# EAGLE design sensor_board_v0.3 (EAGLE 7.6.0)
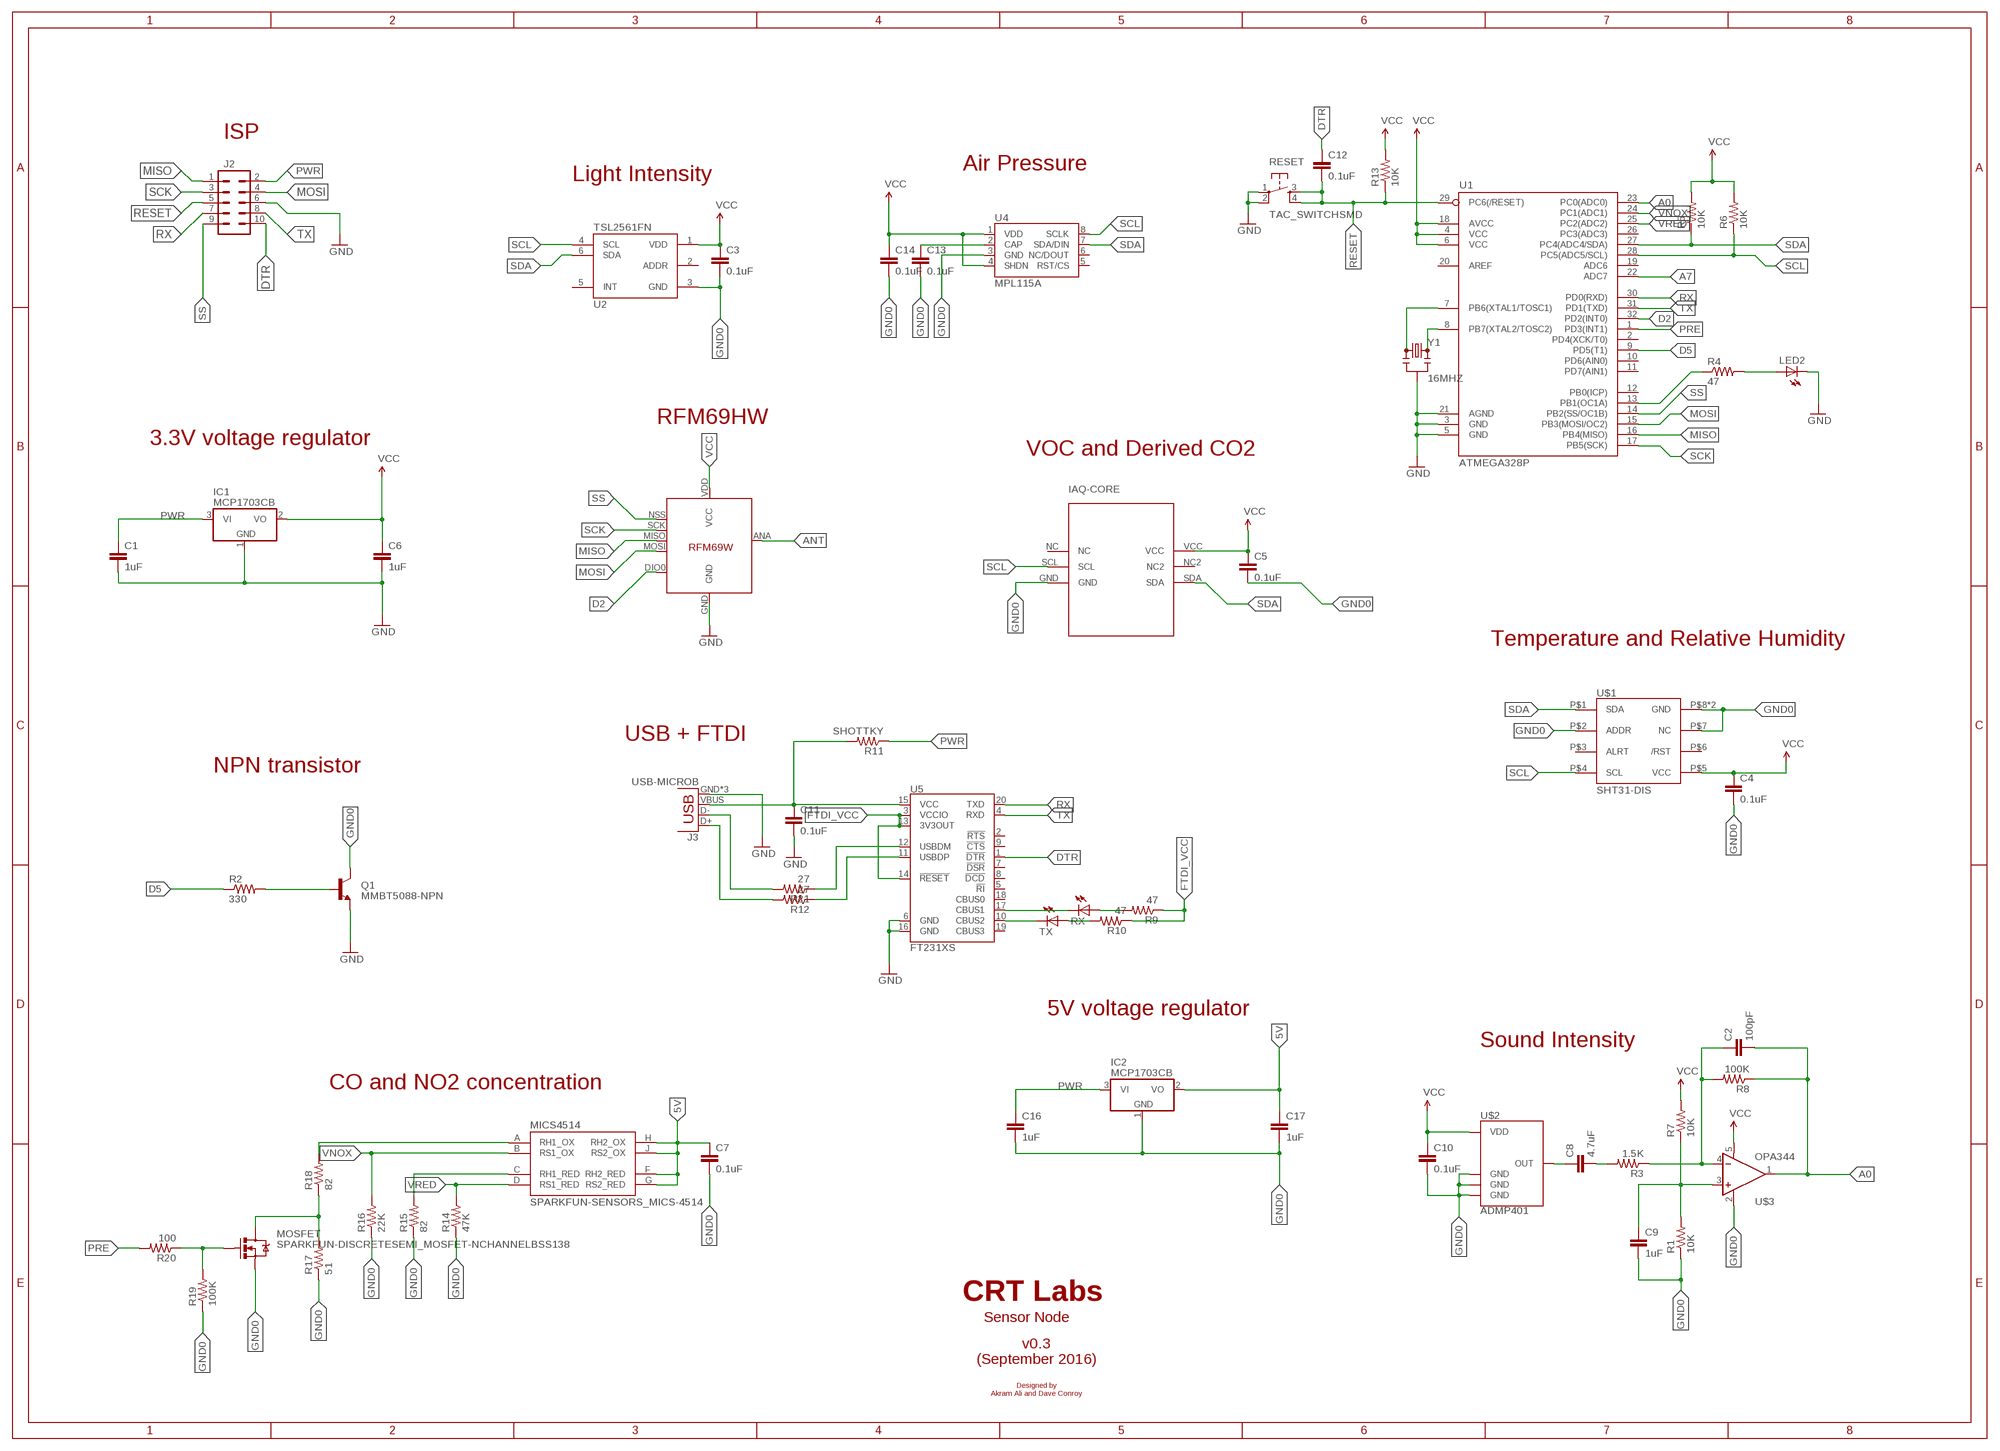
[diagram p0: schematic, sheet 1]

## Parts
C1  1uF  CAP0805  [0805]
C2  100pF  CAP0805  [0805]
C3  0.1uF  CAP0805  [0805]
C4  0.1uF  CAP0805  [0805]
C5  0.1uF  CAP0805  [0805]
C6  1uF  CAP0805  [0805]
C7  0.1uF  CAP0805  [0805]
C8  4.7uF  CAP0805  [0805]
C9  1uF  CAP0805  [0805]
C10  0.1uF  CAP0805  [0805]
C11  0.1uF  CAP0805  [0805]
C12  0.1uF  CAP0805  [0805]
C13  0.1uF  CAP0805  [0805]
C14  0.1uF  CAP0805  [0805]
C16  1uF  CAP0805  [0805]
C17  1uF  CAP0805  [0805]
IAQ-CORE  IAQ-CORE  [IAQ-CORE]
IC1  MCP1703CB  [SOT23]
IC2  MCP1703CB  [SOT23]
J2  M05X2PTH  [AVR_ICSP]
J3  USB-MICROB  [USB-MICROB]
LED2  LEDCHIPLED_0805  [CHIPLED_0805]
MICS4514  SPARKFUN-SENSORS_MICS-4514  [SPARKFUN-SENSORS_MICS_10-SMD]
MOSFET  SPARKFUN-DISCRETESEMI_MOSFET-NCHANNELBSS138  [SPARKFUN-DISCRETESEMI_SOT23-3]
Q1  MMBT5088-NPN  TRANSISTOR_NPNMMBT5088  [SOT23-3]
R1  10K  RESISTOR0805-RES  [0805]
R2  330  RESISTOR0805-RES  [0805]
R3  1.5K  RESISTOR0805-RES  [0805]
R4  47  RESISTOR0805-RES  [0805]
R5  10K  RESISTOR0805-RES  [0805]
R6  10K  RESISTOR0805-RES  [0805]
R7  10K  RESISTOR0805-RES  [0805]
R8  100K  RESISTOR0805-RES  [0805]
R9  47  RESISTOR0805-RES  [0805]
R10  47  RESISTOR0805-RES  [0805]
R11  SHOTTKY  RESISTOR0805-RES  [0805]
R12  27  RESISTOR0805-RES  [0805]
R13  10K  RESISTOR0805-RES  [0805]
R14  47K  RESISTOR0805-RES  [0805]
R15  82  RESISTOR0805-RES  [0805]
R16  22K  RESISTOR0805-RES  [0805]
R17  51  RESISTOR0805-RES  [0805]
R18  82  RESISTOR0805-RES  [0805]
R19  100K  RESISTOR0805-RES  [0805]
R20  100  RESISTOR0805-RES  [0805]
R21  27  RESISTOR0805-RES  [0805]
RESET  TAC_SWITCHSMD  [TACTILE-SWITCH-SMD]
RX  LEDCHIPLED_0805  [CHIPLED_0805]
TX  LEDCHIPLED_0805  [CHIPLED_0805]
U1  ATMEGA328P  ATMEGA328P_TQFP  [TQFP32-08]
U2  TSL2561FN  [FN-6]
U4  MPL115A  [LGA8]
U5  FT231XS  [SSOP20_L]
U$1  SHT31-DIS  [SHT3X]
U$2  ADMP401  [ADMP401]
U$3  OPA344  [SOT23-5]
U$4  RFM69HW  LOWPOWERLAB_RFM69  [LOWPOWERLAB_RFM69W-MINPADS]
Y1  16MHZ  RESONATOR16MHZ  [RESONATOR-SMD]

## Nets
5V: C7.1 C17.1 IC2.2(VO) MICS4514.F(RH2_RED) MICS4514.G(RS2_RED) MICS4514.H(RH2_OX) MICS4514.J(RS2_OX)
A0: C2.2 R8.1 U1.23(PC0(ADC0)) U$3.1(OUT)
A7: U1.22(ADC7)
ANT: U$4.ANA(ANT)
D2: U1.32(PD2(INT0)) U$4.DIO0
D5: R2.1 U1.9(PD5(T1))
DTR: C12.1 J2.10 U5.1(!DTR)
FTDI_VCC: R9.1 R10.1 U5.3(VCCIO) U5.13(3V3OUT) U5.14(!RESET)
GND: C1.2 C6.2 C11.2 IC1.1(GND) J2.6 J3.GND J3.MT1(GND) J3.MT2(GND) LED2.C Q1.2(E) RESET.1 RESET.2 U1.3(GND) U1.5(GND) U1.21(AGND) U5.6(GND) U5.16(GND) U$4.GND Y1.2
GND0: C3.2 C4.2 C5.2 C7.2 C9.2 C10.2 C13.2 C14.2 C16.2 C17.2 IAQ-CORE.GND IC2.1(GND) MOSFET.2(S) Q1.3(C) R1.1 R14.1 R15.1 R16.1 R17.1 R19.1 U2.3(GND) U4.3(GND) U$1.P$2(ADDR) U$1.P$7(NC) U$1.P$8(GND) U$1.PAD(GND) U$2.2(GND) U$2.4(GND) U$2.6(GND) U$3.2(V-)
MISO: J2.1 U1.16(PB4(MISO)) U$4.MISO
MOSI: J2.4 U1.15(PB3(MOSI/OC2)) U$4.MOSI
N$1: Q1.1(B) R2.2
N$2: R4.1 U1.13(PB1(OC1A))
N$3: LED2.A R4.2
N$4: U1.8(PB7(XTAL2/TOSC2)) Y1.3
N$5: U1.7(PB6(XTAL1/TOSC1)) Y1.1
N$7: C8.1 U$2.1(OUT)
N$8: MICS4514.A(RH1_OX) R18.2
N$9: C8.2 R3.2
N$10: C2.1 R3.1 R8.2 U$3.4(-IN)
N$11: C9.1 R1.2 R7.1 U$3.3(+IN)
N$12: C13.1 U4.2(CAP)
N$13: MICS4514.C(RH1_RED) R15.2
N$17: RX.C U5.17(CBUS1)
N$18: TX.C U5.10(CBUS2)
N$20: MOSFET.3(D) R17.2 R18.1
N$23: MOSFET.1(G) R19.2 R20.1
N$24: C11.1 J3.VBUS R11.2 U5.15(VCC)
N$25: R21.1 U5.12(USBDM)
N$26: R12.1 U5.11(USBDP)
N$27: R9.2 RX.A
N$29: R10.2 TX.A
N$32: J3.D- R21.2
N$33: J3.D+ R12.2
PRE: R20.2 U1.1(PD3(INT1))
PWR: C1.1 C16.1 IC1.3(VI) IC2.3(VI) J2.2 R11.1
RESET: C12.2 J2.5 R13.1 RESET.3 RESET.4 U1.29(PC6(/RESET))
RX: J2.7 U1.30(PD0(RXD)) U5.20(TXD)
SCK: J2.3 U1.17(PB5(SCK)) U$4.SCK
SCL: IAQ-CORE.SCL R6.1 U1.28(PC5(ADC5/SCL)) U2.4(SCL) U4.8(SCLK) U$1.P$4(SCL)
SDA: IAQ-CORE.SDA R5.1 U1.27(PC4(ADC4/SDA)) U2.6(SDA) U4.7(SDA/DIN) U$1.P$1(SDA)
SS: J2.9 U1.14(PB2(SS/OC1B)) U$4.NSS(SEL)
TX: J2.8 U1.31(PD1(TXD)) U5.4(RXD)
VCC: C3.1 C4.1 C5.1 C6.1 C10.1 C14.1 IAQ-CORE.VCC IC1.2(VO) R5.2 R6.2 R7.2 R13.2 U1.4(VCC) U1.6(VCC) U1.18(AVCC) U2.1(VDD) U4.1(VDD) U4.4(SHDN) U$1.P$5(VCC) U$2.5(VDD) U$3.5(V+) U$4.VDD(VCC)
VNOX: MICS4514.B(RS1_OX) R16.2 U1.24(PC1(ADC1))
VRED: MICS4514.D(RS1_RED) R14.2 U1.25(PC2(ADC2))
Unconnected: IAQ-CORE.NC IAQ-CORE.NC2 U1.2(PD4(XCK/T0)) U1.10(PD6(AIN0)) U1.11(PD7(AIN1)) U1.12(PB0(ICP)) U1.19(ADC6) U1.20(AREF) U1.26(PC3(ADC3)) U2.2(ADDR) U2.5(INT) U4.5(RST/CS) U4.6(NC/DOUT) U5.2(!RTS) U5.5(!RI) U5.7(!DSR) U5.8(!DCD) U5.9(!CTS) U5.18(CBUS0) U5.19(CBUS3) U$1.P$3(ALRT) U$1.P$6(/RST)

## Notes on the sheet
- ISP
- Air Pressure
- Light Intensity
- RFM69HW
- 3.3V voltage regulator
- VOC and Derived CO2
- Temperature and Relative Humidity
- USB + FTDI
- NPN transistor
- 5V voltage regulator
- Sound Intensity
- CO and NO2 concentration
- CRT Labs
- Sensor Node
- v0.3
  (September 2016)
- Designed by
  Akram Ali and Dave Conroy

## Library data of the parts
C1 C2 C6 C8-C11 C16 C17 = SparkFun-Capacitors:CAP: Capacitor Standard 0603 ceramic capacitor, and 0.1" leaded capacitor.; OC_NEWARK: unknown
C3-C5 C7 = SparkFun-Passives:CAP: Capacitor Standard 0603 ceramic capacitor, and 0.1" leaded capacitor.; OC_NEWARK: unknown
C12-C14 = SparkFun-Passives:CAP: Capacitor Standard 0603 ceramic capacitor, and 0.1" leaded capacitor.
IAQ-CORE = IAQ-CORE:IAQ-CORE; MPN: IAQ CORE; OC_NEWARK: 82Y5455
IC1 IC2 = linear:MCP1703: 250 mA, 16V, Low Quiescent Current LDO Regulator Source: http://ww1.microchip.com/downloads/en/DeviceDoc/22049b.pdf; MPN: MCP1703T-2502E/CB; OC_NEWARK: 18T9177
J2 = SparkFun-Connectors:M05X2: Header 5x2 Standard 10-pin dual row 0.1" header. Commonly used with AVR-ISP. Use with Spark Fun Electronics SKU: PRT-00778
J3 = SparkFun-Connectors:USB: USB Connectors USB-B-PTH is fully proven SKU : PRT-00139/CONN-08278 USB-miniB is fully proven SKU : PRT-00587 USB-A-PCB is untested. USB-A-H is throughly reviewed, but untested. Spark Fun Electronics SKU : PRT-00437 USB-B-SMT is throughly reviewed, but untested. Needs silkscreen touching up. USB-A-S has not been used/tested USB-MB-H has not been used/tested USB-MICROB has been used. CONN-09505; PROD_ID: CONN-09505
LED2 RX TX = adafruit:LED: LED OSRAM: - CHIPLED LG R971, LG N971, LY N971, LG Q971, LY Q971, LO R971, LY R971 LH N974, LH R974 LS Q976, LO Q976, LY Q976 LO Q996 - Hyper CHIPLED LW Q18S LB Q993, LB Q99A, LB R99A - SideLED LS A670, LO A670, LY A670, LG A670, LP A670 LB A673, LV A673, LT A673, LW A673 LH A674 LY A675 LS A676, LA A676, LO A676, LY A676, LW A676 LS A679, LY A679, LG A679 - Hyper Micro SIDELED® LS Y876, LA Y876, LO Y876, LY Y876 LT Y87S - SmartLED LW L88C, LW L88S LB L89C, LB L89S, LG L890 LS L89K, LO L89K, LY L89K LS L896, LA L896, LO L896, LY L896 - TOPLED LS T670, LO T670, LY T670, LG T670, LP T670 LSG T670, LSP T670, LSY T670, LOP T670, LYG T670 LG T671, LOG T671, LSG T671 LB T673, LV T673, LT T673, LW T673 LH T674 LS T676, LA T676, LO T676, LY T676, LB T676, LH T676, LSB T676, LW T676 LB T67C, LV T67C, LT T67C, LS T67K, LO T67K, LY T67K, LW E67C LS E67B, LA E67B, LO E67B, LY E67B, LB E67C, LV E67C, LT E67C LW T67C LS T679, LY T679, LG T679 LS T770, LO T770, LY T770, LG T770, LP T770 LB T773, LV T773, LT T773, LW T773 LH T774 LS E675, LA E675, LY E675, LS T675 LS T776, LA T776, LO T776, LY T776, LB T776 LHGB T686 LT T68C, LB T68C - Hyper Mini TOPLED® LB M676 - Mini TOPLED Santana® LG M470 LS M47K, LO M47K, LY M47K Source: http://www.osram.convergy.de/; OC_NEWARK: unknown
MICS4514 = MICS-4514_CO_and_NOx_Sensor_Breakout:SPARKFUN-SENSORS_MICS-4514: Metal oxide MEMS carbon monoxide (CO) and NOx sensor in an SMD package.; PROD_ID: COMP-12310
MOSFET = MICS-4514_CO_and_NOx_Sensor_Breakout:SPARKFUN-DISCRETESEMI_MOSFET-NCHANNEL: Common NMOSFET Parts MFG P/N Store ID Prod ID FDD8780 TRANS-09984 SI7820DN TRANS-11055 FDS6630A IC-08089 2N7002PW TRANS-11151 FQP30N06L COM-10213 TRANS-10060 BSS123LT1G TRANS-08345 BSS138 TRANS-00830 BS170 2N7000; PROD_ID: TRANS-00830
Q1 = SparkFun-DiscreteSemi:TRANSISTOR_NPN: Generic NPN BJT MMBT2222A - TRANS-08049 (SOT-23, 1A 40V) MPSA42 - TRANS-09116 (SOT-23, 500mA 300V) MMBT5088LT1G - TRANS-11160 (SOT-23, 50 mA 30V) BC547 - COM-08928 <http://www.sparkfun.com/products/8928> (TO-92 45V 100mA) (1.Collector 2.Base 3.Emitter) 2N3904 - COM-00521 <http://www.sparkfun.com/products/521> (TO-92 40V 200mA) (1.Emitter 2.Base 3.Collector) P2N2222A - COM-12852 <http://www.sparkfun.com/products/12852> (TO-92 40V 600mA) (1.Collector 2.Base 3.Emitter); OC_NEWARK: unknown; PROD_ID: TRANS-11160; VALUE: MMBT5088
R1-R3 R7-R12 R14-R21 = SparkFun-Passives:RESISTOR: Resistor Basic schematic elements and footprints for 0603, 1206, and PTH resistors.; OC_NEWARK: unknown
R4-R6 = SparkFun-Resistors:RESISTOR: Resistor Basic schematic elements and footprints for 0603, 1206, and PTH resistors.; OC_NEWARK: unknown
R13 = SparkFun-Passives:RESISTOR: Resistor Basic schematic elements and footprints for 0603, 1206, and PTH resistors.
RESET = SparkFun-Retired:TAC_SWITCH: Momentary Switch Button commonly used for reset or general input. Spark Fun Electronics SKU : COM-00097 SMT- SWCH-08247; PROD_ID: SWCH-08247
U1 = SparkFun-DigitalIC:ATMEGA328P_TQFP; MPN: ATMEGA328PB-AU; OC_NEWARK: 58Y6083; PROD_ID: IC-09069; VALUE: ATMEGA328P_TQFP
U2 = SparkFun-DigitalIC:TSL2561: TSL2561 illumination sensor Approximates Human Eye Response Precisely Measures Illuminance Programmable Interrupt Function with User-Defined Upper and Lower Threshold 400 KHz I2C interface Programmable Analog Gain and Integration Time Supporting 1,000,000-to-1 Dynamic Range Automatically Rejects 50/60-Hz Lighting Ripple Low Active Power (0.75 mW Typical) with Power Down Mode RoHS Compliant The TSL2561 is a light-to-digital converter that transform light intensity to a digital signal output via I2C interface. The device combines one broadband photodiode (visible plus infrared) and one infrared-responding photodiode on a single CMOS integrated circuit capable of providing a near-photopic response over an effective 20-bit dynamic range (16-bit resolution). Two integrating ADCs convert the photodiode currents to a digital output that represents the irradiance measured on each channel. This digital output can be input to a microprocessor where illuminance (ambient light level) in lux is derived using an empirical formula to approximate the human eye response. The TSL2561 device supports a traditional level style interrupt that remains asserted until the firmware clears it.; DIGIKEY#: TSL2561-FNCT-ND; MANF: AMS-TAOS-USA-Inc.; MANF#: TSL2561FN; MOUSER#: 856-TSL2561T; MPN: TSL2561FN; OC_NEWARK: 82Y5564; PROD_ID: IC-11791
U4 = SparkFun-Sensors:MPL115A: MPL115A1 (SPI) and MPL115A2 (I2C) Miniature Digital Barometer 5.0x3.0x1.2mm LGA Package
U5 = SparkFun-DigitalIC:FT231X: FTDI FT231X Full Speed USB to Full-handshake UART This USB2.0 Full Speed IC offers a compact bridge to full handshake UART interfaces. The device is a UART, capable of operating up to 3MBaud, with low power consumption (8mA). The FT231X includes the complete FT-X series feature set and enables USB to be added into a system design quickly and easily over a UART interface.; PROD_ID: IC-11524
U$1 = thomasb9511:SHT31-DIS; MPN: SHT31-DIS-B; OC_NEWARK: 47Y1304
U$2 = SparkFun-Sensors:ADMP401: Omnidirection bottom-port MEMS microphone
U$3 = SparkFun-AnalogIC:OPA344: Single gate rail-to-rail output op-amp. Inputs extend 300mV past rails.; PROD_ID: IC-08251
U$4 = RFM69 USB Gateway:LOWPOWERLAB_RFM69
Y1 = SparkFun-FreqCtrl:RESONATOR: Resonator Small SMD resonator. Used, eg, on the Arduino Pro/ Pro Mini boards. 8MHz- XTAL-08895 16MHz- XTAL-08900; OC_NEWARK: unknown; PROD_ID: XTAL-08900

## Board
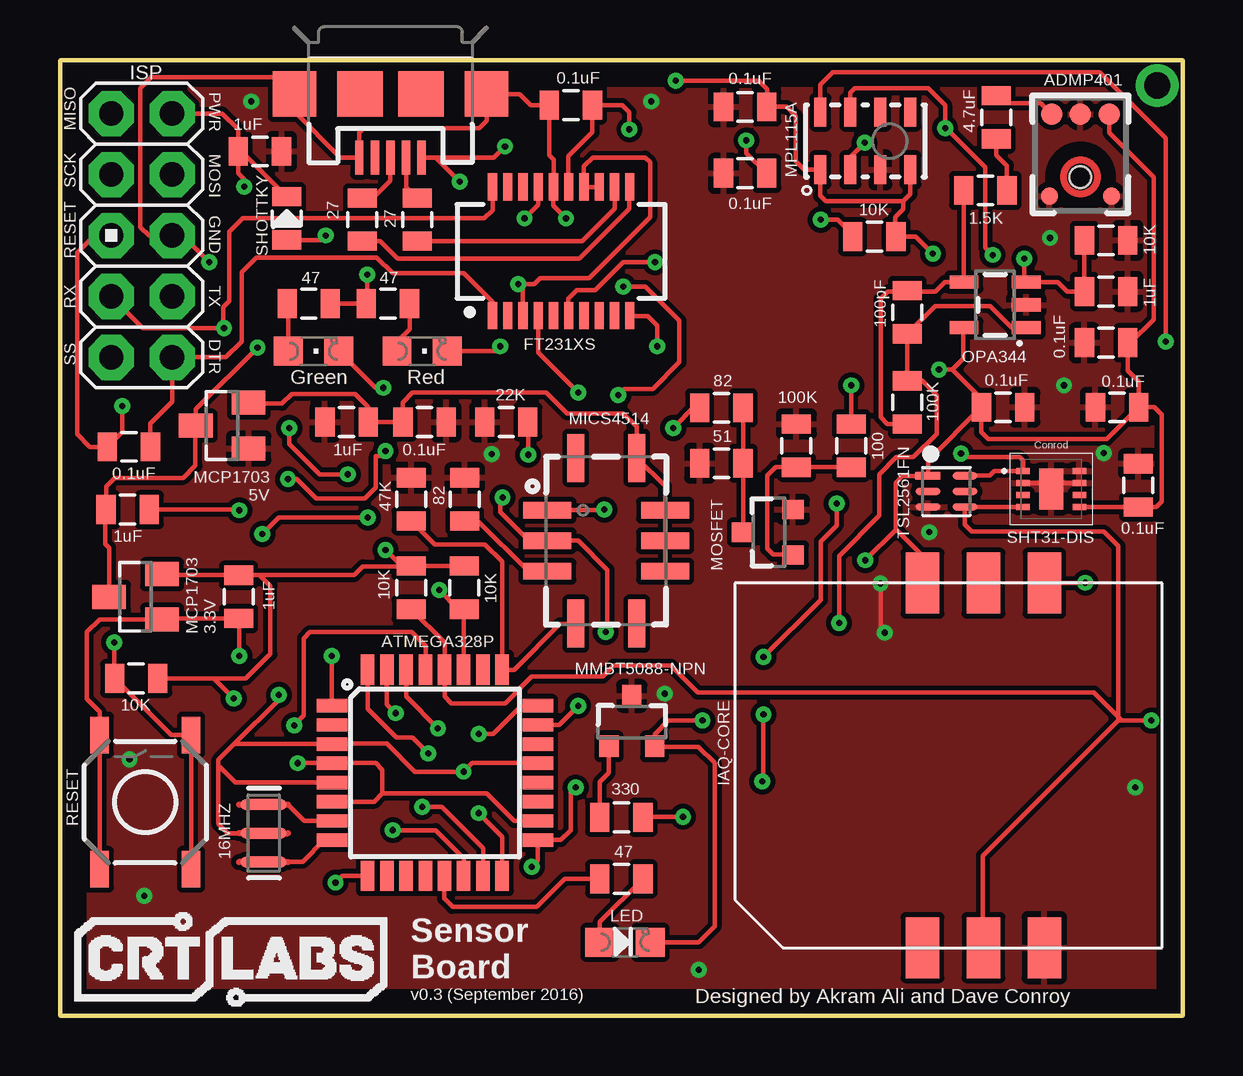
[diagram p1: board, top side]
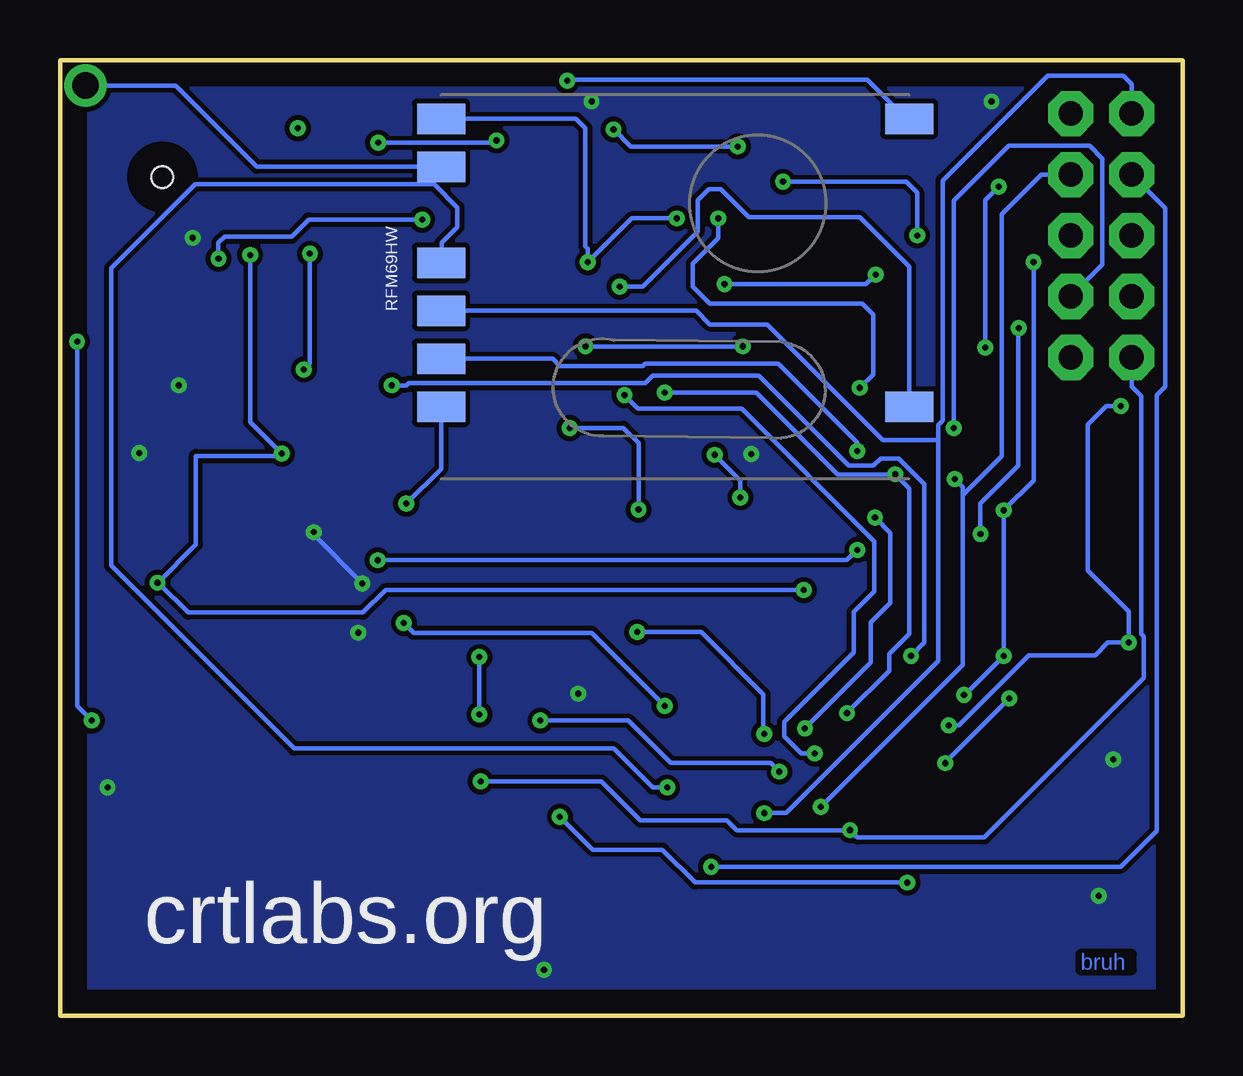
[diagram p2: board, bottom side, seen from below]

Size 46.79 x 39.85 mm. Coordinates in mm from the lower left corner, seen from the top.
Outline: 0.03,39.85 46.79,39.85 46.79,0 0,0 0,39.83
Copper layers (1*16): Top 0.035mm / dielectric 1.5mm / Bottom 0.035mm
Design rules "default": minimum track width 10mil, minimum drill 24mil, track to track 8mil, track to pad 8mil, pad to pad 8mil, via to via 8mil, smd to smd 8mil, copper to edge 40mil, drill to drill 8mil, minimum pad ring 10mil, minimum via ring 8mil, stop-mask expansion 4mil, vias tented up to drill 0mil, thermal gap 10mil

### Footprints (pad centres in the part's own frame; a part is rotated, then mirrored left to right if it is on the bottom)
0805 = smd 0.8 x 1.2: 1 -0.9,0; 2 0.9,0
IAQ-CORE = smd 2.54 x 1.4: GND 0,-12.9; NC 0,-7.82; NC2 15.2,-10.36; SCL 0,-10.36; SDA 15.2,-12.9; VCC 15.2,-7.82
SOT23 = smd 1 x 1.4: 1 -0.95,-1.1; 2 0.95,-1.1; 3 0,1.1
AVR_ICSP = drill 1.016 pad 1.88 octagon: 1 -1.27,5.08; 2 1.27,5.08; 3 -1.27,2.54; 4 1.27,2.54; 5 -1.27,0; 6 1.27,0; 7 -1.27,-2.54; 8 1.27,-2.54; 9 -1.27,-5.08; 10 1.27,-5.08
USB-MICROB = smd 0.35 x 1.4: D+ 0,2.65; D- -0.65,2.65; GND 1.3,2.65; ID 0.65,2.65; VBUS -1.3,2.65 | smd 1.8 x 1.9: MT1 -4,0; MT2 4,0 | smd 1.9 x 1.9: P$1 -1.27,0; P$2 1.27,0
CHIPLED_0805 = smd 1.2 x 1.2: A 0,-1.05; C 0,1.05
SPARKFUN-SENSORS_MICS_10-SMD = smd 0.7 x 2: A 1.27,2.45; B 0,2.45; C -1.27,2.45; F -1.27,-2.45; G 0,-2.45; H 1.27,-2.45 | smd 2 x 0.7: D -3.45,1.27; E -3.45,-1.27; J 3.45,-1.27; K 3.45,1.27
SPARKFUN-DISCRETESEMI_SOT23-3 = smd 0.8 x 0.9: 1 -0.95,-1; 2 0.95,-1; 3 0,1.1
SOT23-3 = smd 0.8 x 0.9: 1 -0.95,-1; 2 0.95,-1; 3 0,1.1
TACTILE-SWITCH-SMD = smd 1.524 x 0.762: 1 -2.794,1.905; 2 2.794,1.905; 3 -2.794,-1.905; 4 2.794,-1.905
TQFP32-08 = smd 1.27 x 0.559: 1 -4.293,2.8; 2 -4.293,2; 3 -4.293,1.2; 4 -4.293,0.4; 5 -4.293,-0.4; 6 -4.293,-1.2; 7 -4.293,-2; 8 -4.293,-2.8; 17 4.293,-2.8; 18 4.293,-2; 19 4.293,-1.2; 20 4.293,-0.4; 21 4.293,0.4; 22 4.293,1.2; 23 4.293,2; 24 4.293,2.8 | smd 0.559 x 1.27: 9 -2.8,-4.293; 10 -2,-4.293; 11 -1.2,-4.293; 12 -0.4,-4.293; 13 0.4,-4.293; 14 1.2,-4.293; 15 2,-4.293; 16 2.8,-4.293; 25 2.8,4.293; 26 2,4.293; 27 1.2,4.293; 28 0.4,4.293; 29 -0.4,4.293; 30 -1.2,4.293; 31 -2,4.293; 32 -2.8,4.293
FN-6 = smd 1.05 x 0.3: 1 -0.775,0.65; 2 -0.775,0; 3 -0.775,-0.65; 4 0.775,-0.65; 5 0.775,0; 6 0.775,0.65
LGA8 = smd 1.2 x 0.5: 1 -1.2,1.875; 2 -1.2,0.625; 3 -1.2,-0.625; 4 -1.2,-1.875; 5 1.2,-1.875; 6 1.2,-0.625; 7 1.2,0.625; 8 1.2,1.875
SSOP20_L = smd 0.381 x 1.143: 1 -2.857,-2.68; 2 -2.223,-2.68; 3 -1.587,-2.68; 4 -0.953,-2.68; 5 -0.318,-2.68; 6 0.318,-2.68; 7 0.953,-2.68; 8 1.587,-2.68; 9 2.223,-2.68; 10 2.857,-2.68; 11 2.857,2.68; 12 2.223,2.68; 13 1.587,2.68; 14 0.953,2.68; 15 0.318,2.68; 16 -0.318,2.68; 17 -0.953,2.68; 18 -1.587,2.68; 19 -2.223,2.68; 20 -2.857,2.68
SHT3X = smd 0.55 x 0.25: P$1 -1.175,0.75; P$2 -1.175,0.25; P$3 -1.175,-0.25; P$4 -1.175,-0.75; P$5 1.175,-0.75; P$6 1.175,-0.25; P$7 1.175,0.25; P$8 1.175,0.75 | smd 1 x 1.7: PAD 0,0
ADMP401 = smd 0.9 x 0.9: 1 -1.2,2.62; 5 1.2,2.62; 6 0,2.62 | smd 0.7 x 0.7: 2 1.3,-0.8; 4 -1.3,-0.8 | hole 0.9: 0,0
SOT23-5 = smd 0.55 x 1.2: 1 -0.95,-1.3; 2 0,-1.3; 3 0.95,-1.3; 4 0.95,1.3; 5 -0.95,1.3
LOWPOWERLAB_RFM69W-MINPADS = smd 2 x 1.27: ANA 8,-5; DIO0 -11.5,5; GND 8,-7; MISO 8,1; MOSI 8,3; NSS 8,5; SCK 8,-1; VDD -11.5,-7
RESONATOR-SMD = smd 0.45 x 1.905: 1 -1.2,0; 2 0,0; 3 1.2,0

### Placement (x,y rotation side)
C1  2.82,21.11 0 top
C2  35.31,29.34 270 top
C3  39.29,25.37 0 top
C4  44.04,25.37 180 top
C5  44.93,22.12 90 top
C6  7.44,17.48 270 top
C7  15.19,24.77 0 top
C8  39.01,37.47 270 top
C9  43.59,30.2 0 top
C10  43.59,28.07 180 top
C11  21.29,37.97 180 top
C12  2.87,23.72 180 top
C13  28.55,35.13 180 top
C14  28.55,37.9 180 top
C16  8.33,36.04 0 top
C17  11.94,24.77 180 top
IAQ-CORE  28.12,2.84 90 top
IC1  3.15,17.48 90 top
IC2  6.76,24.61 90 top
J2  3.4,32.54 0 top
J3  13.77,38.43 180 top
LED2  23.55,3.07 270 top
MICS4514  22.76,19.81 90 top
MOSFET  29.54,20.17 90 top
Q1  23.83,12.24 0 top
R1  43.59,32.33 180 top
R2  23.39,8.28 180 top
R3  38.56,34.42 0 top
R4  23.39,5.71 0 top
R5  16.84,17.86 90 top
R6  14.63,17.86 90 top
R7  33.93,32.49 0 top
R8  35.31,25.58 270 top
R9  10.36,29.69 180 top
R10  13.67,29.69 0 top
R11  9.45,33.25 270 top
R12  12.6,33.2 90 top
R13  3.17,14.07 0 top
R14  14.63,21.54 270 top
R15  16.87,21.54 270 top
R16  18.59,24.77 0 top
R17  27.56,23.04 0 top
R18  27.56,25.35 180 top
R19  30.68,23.77 270 top
R20  32.97,23.77 90 top
R21  14.88,33.2 90 top
RESET  3.56,8.92 90 top
RX  10.57,27.71 270 top
TX  15.09,27.71 270 top
U1  15.62,10.13 0 top
U2  36.93,21.87 0 top
U4  33.55,36.47 90 top
U5  20.88,31.88 0 top
U$1  41.3,21.97 0 top
U$2  42.52,34.98 0 top
U$3  38.96,29.64 90 top
U$4  22.91,30.4 180 bottom
Y1  8.48,7.62 270 top

### Tracks (layer width: path | path; a pad name or v marks a point on that pad's centre or on a via)
5V
  Top 0.178: MICS4514.F MICS4514.G MICS4514.H 25.21,22.08 MICS4514.J 24.03,24.56 23.47,25.12 21.13,25.12 20.27,25.98 14.68,25.98 14.28,25.58 14.28,24.78 C7.1 C17.1 12.84,25.39 12.29,25.93 9.65,25.93 9.25,25.53 7.89,25.53 IC2.2
A0  (via drill 0.25 pad 0.13)
  Top 0.178: U1.23 20.8,12.13 v21.59,12.93 | v32.46,16.38 32.46,19.18 34.14,20.85 34.14,22.58 34.85,23.29 35.56,23.29 36.53,24.26 36.53,25.88 35.93,26.48 R8.1 C2.2 36.46,29.59 38.76,29.59 39.66,28.69 U$3.1
  Bottom 0.178: v21.59,12.93 24.64,15.98 32.06,15.98 v32.46,16.38
ANT  (via drill 1.1 pad 1.78)
  Bottom 0.178: U$4.ANA 38.58,35.4 41.96,38.79 v45.72,38.79
D2  (via drill 0.25 pad 0.13)
  Top 0.178: v23.27,25.88 23.52,26.14 24.69,26.14 25.81,27.25 25.81,28.98 24.38,30.4 v23.47,30.4 | U1.32 12.82,12.81 14.02,11.61 14.68,11.61 v15.34,10.95
  Bottom 0.178: U$4.DIO0 11.41,31.25 13.46,33.3 18.09,33.3 19.25,34.47 19.76,34.47 20.22,34.01 20.22,32.69 22.5,30.4 v23.47,30.4 | v15.34,10.95 15.9,10.95 16.61,11.66 16.61,12.27 13.72,15.16 13.72,16.84 12.85,17.7 12.85,19.79 18.39,25.32 22.71,25.32 v23.27,25.88
D5  (via drill 0.25 pad 0.13)
  Top 0.178: 24.31,8.29 R2.1 24.32,8.31 v25.96,8.31 | U1.9 11.76,5.84 v11.48,5.56
  Bottom 0.178: v11.48,5.56 20.32,5.56 21.69,6.93 24.59,6.93 v25.96,8.31
DTR
  Top 0.178: C12.1 3.77,24.7 4.67,25.6 J2.10 | 4.72,27.51 J2.10 | U5.1 18.02,29.76 16.82,30.96 13.87,30.96 13.21,31.62 8.18,31.62 7.57,31.01 7.57,28.12 6.91,27.46 J2.10
FTDI_VCC  (via drill 0.25 pad 0.13)
  Top 0.178: U5.13 U5.14 21.83,35.42 22.2,35.79 24.38,35.79 24.59,35.59 24.59,33.3 22.05,30.76 20.02,30.76 19.76,30.51 v19.1,30.51 19.29,30.31 U5.3 | R10.1 R9.1 11.28,30.16 | 12.75,30.16 R10.1 | v12.8,30.91 12.8,29.73 R10.1
  Bottom 0.178: v19.1,30.51 13.21,30.51 v12.8,30.91
GND  (via drill 0.25 pad 0.13)
  Top 0.178: RESET.1 RESET.2 1.65,12.67 1.12,13.21 1.12,16 1.65,16.54 4.24,16.54 IC1.1 4.3,16.58 C6.2 7.47,16.55 v7.47,15.01 | 7.27,11.33 U1.3 11.35,11.35 13.61,11.35 14.78,10.19 v16.82,10.19 17.17,10.54 U1.21 | 7.27,11.33 6.6,10.67 6.6,10.44 | v6.22,31.42 5.11,32.54 J2.6 3.71,32.54 3.35,32.89 3.35,38.68 3.81,39.14 9.06,39.14 J3.MT2 9.75,38.42 9.75,37.72 11.68,35.79 J3.GND 12.47,36.83 12.65,37.01 17.48,37.01 17.78,37.31 17.78,38.42 J3.MT1 19.15,38.43 19.61,37.97 C11.2 20.39,35.88 20.57,35.69 20.57,34.57 U5.16 20.56,33.77 v21.08,33.25 | v9.12,13.39 9.12,13.18 7.27,11.33 | 9.5,7.62 6.99,7.62 6.6,8 6.6,10.44 | U1.5 7.31,9.73 6.6,10.44 | v26.77,12.32 25.35,12.32 24.78,11.74 Q1.2 24.79,11.23 26.59,11.23 27.28,10.54 27.28,3.73 26.62,3.07 LED2.C | v24.79,31.42 23.47,31.42 22.3,30.25 21.54,30.25 21.18,29.9 21.18,29.21 U5.6 | C1.2 7.44,21.11 v7.47,21.08
  Bottom 0.178: v9.12,13.39 9.09,13.39 v7.47,15.01 v7.47,21.08 6.22,22.33 v6.22,31.42 | v26.77,12.32 23.11,12.32 21.34,10.54 17.17,10.54 v16.82,10.19 | v21.08,33.25 22.96,33.25 v24.79,31.42 24.79,31.98 24.89,32.08 24.89,37.01 25.29,37.4 U$4.GND
GND0  (via drill 0.25 pad 0.13)
  Top 0.178: U$1.P$2 41.05,22.22 U$1.PAD 41.55,22.22 U$1.P$7 | v34.19,18.03 34.19,16.15 v34.37,15.98
  Bottom 0.178: v36.22,20.17 36.22,20.07 v34.19,18.03
  other vias: 26.62,1.93 41.83,26.29 43.48,23.47 17.98,23.42 41.25,32.44 2.9,10.69 3.51,5 44.81,9.52 7.98,38.13 25.2,13.44 24.64,38.13
  pour Top: -0.33,40.28 47.22,40.28 47.22,-0.43 -0.33,-0.43
  pour Bottom: -0.28,40.28 47.12,40.28 47.12,-0.51 -0.3,-0.51 -0.3,40.28
MISO  (via drill 0.25 pad 0.13)
  Top 0.178: U1.16 18.42,7.46 17.42,8.46 v17.45,8.46
  Bottom 0.178: v17.45,8.46 16.54,8.46 10.19,14.81 10.19,24 | 10.19,24 10.19,24.64 10.01,24.82 10.01,34.82 5.64,39.19 2.49,39.19 2.13,38.84 J2.1 | U$4.MISO 20.29,29.4 19.71,28.83 17.32,28.83 12.5,24 10.19,24
MOSI  (via drill 0.25 pad 0.13)
  Top 0.178: v9.5,22.38 9.86,22.38 10.67,21.56 12.7,21.56 13.16,22.02 13.16,23.34 13.36,23.34 v13.56,23.55 | v15.09,8.71 15.9,8.71 17.63,6.98 U1.15
  Bottom 0.178: 9.17,21.72 9.17,14.63 v15.09,8.71 | 9.17,21.72 7.54,23.34 7.54,33.43 5.89,35.08 J2.4 | U$4.MOSI 26.26,27.4 25.96,27.1 22.5,27.1 22.4,27.2 16.87,27.2 13.56,23.9 v13.56,23.55 | 9.17,21.72 9.17,22.05 v9.5,22.38
N$1
  Top 0.178: Q1.1 22.86,11.23 22.86,10.13 22.49,9.77 R2.2
N$2
  Top 0.178: R4.1 21.03,5.71 19.86,4.55 16.36,4.55 16,4.9 16,5.82 U1.13
N$3
  Top 0.178: LED2.A 22.5,3.92 R4.2
N$4
  Top 0.178: U1.8 11.02,7.33 10.11,6.43 Y1.3
N$5
  Top 0.178: U1.7 10.19,8.13 9.5,8.82
N$7
  Top 0.178: C8.1 39.48,38.05 40.86,38.05 U$2.1
N$8  (via drill 0.25 pad 0.13)
  Top 0.178: MICS4514.A 22.66,21.08 v22.68,21.11 | R18.2 26.63,25.37 26.42,25.37 v25.55,24.51
  Bottom 0.178: v22.68,21.11 22.68,23.88 23.32,24.51 v25.55,24.51
N$9
  Top 0.178: 39.47,34.43 R3.2 39.46,35.45 39.01,35.89 C8.2
N$10
  Top 0.178: R3.1 U$3.4 | U$3.4 | R8.2 34.48,24.68 34.19,24.97 34.19,29.9 34.49,30.2 35.27,30.2 C2.1 35.34,30.2 36.47,30.2 36.87,30.6 U$3.4
N$11  (via drill 0.25 pad 0.13)
  Top 0.178: R1.2 C9.1 41.96,30.2 41.57,30.59 U$3.3 40.18,30.67 v40.18,31.57 | R7.1 33.03,32.57 32.41,33.2 v31.7,33.2
  Bottom 0.178: v31.7,33.2 36.42,33.2 37.14,32.49 39.93,32.49 40.18,32.23 v40.18,31.57
N$12  (via drill 0.25 pad 0.13)
  Top 0.178: 29.46,35.53 29.46,35.14 C13.1 28.6,35.98 v28.6,36.5 | U4.2 32.93,35.8 v33.53,36.4
  Bottom 0.178: v33.53,36.4 28.7,36.4 v28.6,36.5
N$13
  Top 0.178: R15.2 17.41,20.64 19.51,18.54 MICS4514.C
N$17  (via drill 0.25 pad 0.13)
  Top 0.178: U5.17 19.93,33.82 v19.36,33.25 | v13.46,26.19 13.14,26.19 RX.C
  Bottom 0.178: v19.36,33.25 19.36,32.44 20.42,31.37 20.42,30.4 19.71,29.69 13.36,29.69 12.9,29.24 12.9,26.75 v13.46,26.19
N$18  (via drill 0.25 pad 0.13)
  Top 0.178: 23.72,29.18 U5.10 23.75,29.18 24.49,29.18 24.89,28.78 v24.89,27.91 | TX.C 18.14,27.71 v18.34,27.91
  Bottom 0.178: v18.34,27.91 v24.89,27.91
N$20
  Top 0.178: R18.1 R17.2 28.46,20.19 MOSFET.3
N$23
  Top 0.178: R20.1 R19.2 | R19.2 30.8,22.87 | MOSFET.1 30.55,19.23 29.72,19.23 29.46,19.48 29.46,22.53 29.82,22.89 30.67,22.89 R19.2
N$24  (via drill 0.25 pad 0.13)
  Top 0.178: U5.15 21.18,34.57 21.18,35.84 22.19,36.84 C11.1 23.42,37.97 23.72,37.67 v23.72,36.96 | v18.54,36.25 18.08,35.78 J3.VBUS 15.66,35.78 v16.66,34.77 | 9.46,32.33 R11.2 10.89,32.35 v11.07,32.54
  Bottom 0.178: v18.54,36.25 23.01,36.25 v23.72,36.96 | v16.66,34.77 11.53,34.77 11.07,34.32 v11.07,32.54
N$25
  Top 0.178: R21.1 21.76,32.3 23.11,33.65 23.11,34.54 U5.12
N$26
  Top 0.178: R12.1 13.35,32.3 14.07,31.57 21.64,31.57 23.72,33.65 23.72,34.54 U5.11
N$27
  Top 0.178: RX.A 9.52,29.64 R9.2
N$29
  Top 0.178: 14.58,30.14 R10.2 14.58,29.68 14.58,28.63 14.04,28.08 TX.A
N$32
  Top 0.178: J3.D- 14.43,34.55 R21.2
N$33
  Top 0.178: R12.2 13.04,34.1 13.77,34.82 J3.D+
PRE  (via drill 0.25 pad 0.13)
  Top 0.178: v11.33,15.01 U1.1 | R20.2 v32.97,26.29
  Bottom 0.178: v11.33,15.01 10.77,15.57 10.77,22.17 11.84,23.24 12.6,23.24 12.9,22.94 13.92,22.94 17.68,26.7 22.1,26.7 22.4,26.39 32.26,26.39 32.36,26.29 v32.97,26.29
PWR  (via drill 0.25 pad 0.13)
  Top 0.178: R11.1 7.56,36.04 C16.1 7.42,36.06 7.42,36.96 6.76,37.62 J2.2 | IC2.3 5.66,25.29 v8.23,27.86 | v7.67,34.57 7.67,34.87 7.42,35.13 7.42,36.03 | IC1.3 2.05,19.51 1.88,19.68 1.88,21.07 C1.1 1.92,22.06 2.29,22.43 5.13,22.43 5.64,22.94 5.64,24.59
  Top 0.61: 5.64,24.59 IC2.3 | 7.42,36.03 C16.1
  Bottom 0.178: v8.23,27.86 8.23,34.01 v7.67,34.57
RESET  (via drill 0.25 pad 0.13)
  Top 0.178: RESET.3 RESET.4 4.64,11.71 R13.1 2.26,14.09 v2.26,15.57 | J2.5 1.42,32.54 0.71,31.83 0.71,24.26 1.24,23.72 C12.2 2.59,24.34 v2.59,25.43 | 15.22,14.75 U1.29 15.24,14.45 15.24,15.42 14.66,16 10.41,16 10.16,15.75 10.16,12.52 v9.75,12.12
  Bottom 0.178: v9.75,12.12 9.35,12.12 6.43,15.04 3.66,15.04 3.12,15.57 v2.26,15.57 2.26,16.87 3.96,18.57 3.96,24.66 3.2,25.43 v2.59,25.43
RX  (via drill 0.25 pad 0.13)
  Top 0.178: U1.30 14.42,13.32 v15.75,11.99 | J2.7 3.45,28.68 v6.83,28.68 6.81,28.7 6.81,29.54 7.06,29.79 7.06,32.69 7.62,33.25 17.68,33.25 18.02,33.59 U5.20 | v12.83,20.78 9.12,20.78 v8.43,20.09
  Bottom 0.178: v15.75,11.99 13.01,14.73 13.01,16.41 12.19,17.22 12.19,20.14 v12.83,20.78 | 6.99,28.52 v6.83,28.68 6.86,28.65 6.86,22.94 8.43,21.36 v8.43,20.09
SCK  (via drill 0.25 pad 0.13)
  Top 0.178: v19.66,6.22 19.91,6.48 U1.17 20.87,7.33 21.29,7.75 21.29,9.32 v21.49,9.52
  Bottom 0.178: v19.66,6.22 2.59,6.22 1.09,7.72 1.09,25.88 0.74,26.24 0.74,33.68 J2.3 | v21.49,9.52 22.1,9.52 23.72,11.15 37.03,11.15 44.65,18.77 44.65,31.17 41.15,34.67 31.19,34.67 30.23,33.71 30.23,32.89 30.89,32.23 30.89,31.43 U$4.SCK
SCL  (via drill 0.25 pad 0.13)
  Top 0.178: U$1.P$4 U2.4 | U2.4 | U4.8 31.68,38.82 32.21,39.34 43.33,39.34 46.08,36.6 v46.08,28.12 | R6.1 16.02,15.57 U1.28 16.02,13.32 16.31,13.03 18.54,13.03 19.66,14.15 22.61,14.15 23.06,14.6 25.45,14.6 26.57,13.49 43.08,13.49 44.25,12.32 | U2.4 37.71,20.48 38,20.19 43.49,20.19 44.09,19.58 44.09,12.32 | 38.56,2.92 IAQ-CORE.SCL 38.46,2.87 38.46,6.68 44.09,12.32 | v45.47,12.32 44.25,12.32 | 44.25,12.32 44.09,12.32
  Bottom 0.178: v45.47,12.32 46.08,12.93 v46.08,28.12
SDA  (via drill 0.25 pad 0.13)
  Top 0.178: U2.6 38.74,22.53 38.93,22.72 U$1.P$1 40.13,23.15 39.98,23.29 37.69,23.29 v37.54,23.44 | U1.27 16.82,16.94 R5.1 | R5.1 16.7,16.96 | R5.1 16.6,16.96 v15.8,17.75 | U4.7 32.93,38.49 33.12,38.68 36.17,38.68 36.88,37.97 v36.88,37.01 36.93,37.01 38.56,35.38 38.56,32.03 v38.86,31.72 | IAQ-CORE.SDA 42.71,18.04 v42.72,18.06
  Bottom 0.178: v15.8,17.75 33.22,17.75 34.16,16.81 41.45,16.81 42.7,18.06 v42.72,18.06 41.12,19.66 41.12,23.34 37.64,23.34 v37.54,23.44 38.86,24.76 v38.86,31.72
SS  (via drill 0.25 pad 0.13)
  Top 0.178: v13.87,7.75 15.65,7.75 16.82,6.58 U1.14 | v32.36,21.36 32.36,20.45 31.7,19.79 31.7,17.35 v29.31,14.96 | v29.31,12.57 29.31,9.83 v29.26,9.78
  Bottom 0.178: J2.9 2.13,26.24 1.73,25.83 1.73,15.93 1.63,15.82 1.63,14.1 8.28,7.44 13.56,7.44 v13.87,7.75 18.59,7.75 19,8.15 22.61,8.15 24.23,9.78 v29.26,9.78 | U$4.NSS 30.91,22.81 v32.36,21.36 | v29.31,14.96 v29.31,12.57
TX  (via drill 0.25 pad 0.13)
  Top 0.178: U1.31 13.62,13 v14,12.62 | v11.99,22.58 10.82,22.58 9.55,23.85 v9.55,24.51 | U5.4 19.93,27.65 v21.59,25.98
  Bottom 0.178: v14,12.62 12.24,14.38 12.24,15.09 11.4,15.93 11.4,22 v11.99,22.58 14.38,22.58 17.78,25.98 v21.59,25.98 | v9.55,24.51 9.55,33.99 7.26,36.27 3.89,36.27 3.35,35.74 3.35,31.32 J2.8
VCC  (via drill 0.25 pad 0.13)
  Top 0.178: U$1.P$5 C5.1 45.68,21.22 45.9,21.44 45.9,25.07 45.59,25.37 C4.1 | C4.1 43.61,24.04 38.67,24.04 38.38,24.33 38.38,25.36 C3.1 | IAQ-CORE.VCC 35.94,19.18 34.82,20.29 | 34.82,20.29 34.82,22.22 35.1,22.5 36.14,22.5 U2.1 36.17,22.53 36.17,23.15 C3.1 | U4.4 35.43,34.26 35.13,33.96 | 35.13,33.96 31.9,33.96 31.67,34.19 U4.1 31.01,35.28 30.66,35.64 30.66,37.52 30.28,37.9 C14.1 29.46,37.91 29.46,38.63 29.11,38.99 v25.65,38.99 | U1.6 13.1,8.93 13.44,9.27 | 13.44,9.27 13.44,10.26 13.16,10.54 U1.4 | U1.4 | 13.44,9.27 17.78,9.27 18.92,8.13 U1.18 | v7.24,13.23 6.4,14.07 R13.2 7.75,14.07 8.76,15.09 8.76,17.92 8.31,18.38 | U1.4 v9.91,10.54 | IC1.2 4.3,18.38 C6.1 8.31,18.38 | 8.31,18.38 12.25,18.38 12.62,18.75 14.62,18.75 R6.2 | 34.82,20.29 34.82,20.27 v33.55,19 | R5.2 R6.2 | R6.2 14.24,18.76 v13.56,19.43 | 44.91,25.41 C4.1 | 35.13,33.96 35.13,33.63 34.8,33.3 34.8,32.52 R7.2 35.66,32.49 v36.37,31.78 | v36.63,26.95 37.19,26.95 | 37.19,26.95 37.64,27.41 37.64,28.67 U$3.5 | C3.1 38.39,25.74 37.19,26.95 | R6.2 14.63,18.95 14.68,19 | U$2.5 43.72,36.82 45.57,34.98 45.57,29.03 44.6,28.07 C10.1 44.49,26.91 44.96,26.44 44.96,25.39 C4.1
  Bottom 0.178: v9.91,10.54 9.91,10.57 v7.24,13.23 | v33.55,19 14,19 v13.56,19.43 | v36.37,31.78 36.37,27.2 v36.63,26.95 | U$4.VDD 11.52,37.4 13.16,39.04 25.6,39.04 v25.65,38.99
VNOX  (via drill 0.25 pad 0.13)
  Top 0.178: v22.73,16 22.81,16.08 22.81,18.59 21.59,19.81 MICS4514.B 19.53,19.81 18.34,21.01 18.34,21.51 v18.44,21.62 | v17.45,11.76 18.06,11.76 19.23,12.93 U1.24 | v19.51,23.39 R16.2
  Bottom 0.178: v22.73,16 20.07,16 17.48,13.41 17.48,11.79 v17.45,11.76 | v18.44,21.62 18.44,22.33 v19.51,23.39
VRED
  Top 0.178: R14.2 15.61,19.66 17.7,19.66 18.42,18.94 U1.25 18.92,14.43 20.83,16.33 21.46,16.33 MICS4514.D

### Text on the board
Bottom: bruh
_tsilk: ISP | MISO | PWR | SCK | MOSI | RESET | GND | RX | TX | SS | DTR | Green | Red | Conrod | MCP1703 / 5V | MCP1703 / 3.3V | LED | Sensor / Board | v0.3 (September 2016) | Designed by Akram Ali and Dave Conroy
_bsilk: crtlabs.org